# EAGLE schematic PIC32 (EAGLE 8.1.0)
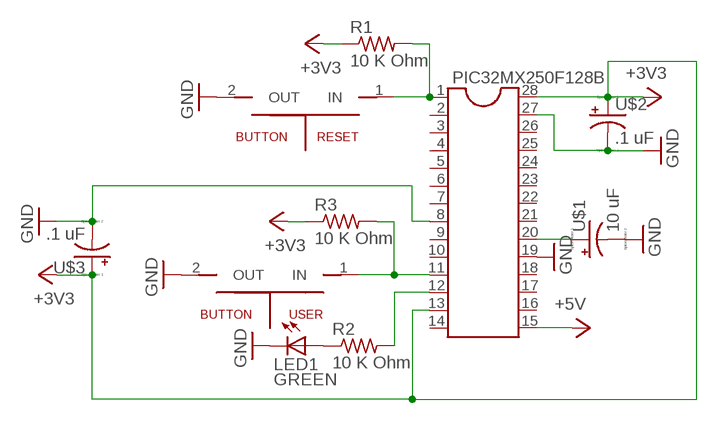
[diagram p0: schematic, sheet 1]

## Parts
LED1  GREEN  LED  [SMARTLED-TTW]
PIC32MX250F128B  DIL28-3  [DIL28-3]
R1  10 K Ohm  R-US_0207/10  [0207/10]
R2  10 K Ohm  R-US_0207/10  [0207/10]
R3  10 K Ohm  R-US_0207/10  [0207/10]
RESET  BUTTON  [BUTTON]
U$1  10 uF  CAP-5  [E2,5-5]
U$2  .1 uF  CAP-4  [E1,8-4]
U$3  .1 uF  CAP-4  [E1,8-4]
USER  BUTTON  [BUTTON]

## Nets
+3V3: PIC32MX250F128B.13 PIC32MX250F128B.28 R1.1 R3.1 U$2.+ U$3.+
+5V: PIC32MX250F128B.15
GND: LED1.C@1(C) PIC32MX250F128B.8 PIC32MX250F128B.19 PIC32MX250F128B.27 RESET.2(OUT) U$1.- U$2.- U$3.- USER.2(OUT)
N$1: PIC32MX250F128B.20 U$1.+
N$2: PIC32MX250F128B.1 R1.2 RESET.1(IN)
N$3: LED1.A@1(A) R2.1
N$4: PIC32MX250F128B.12 R2.2
N$5: PIC32MX250F128B.11 R3.2 USER.1(IN)
Unconnected: PIC32MX250F128B.2 PIC32MX250F128B.3 PIC32MX250F128B.4 PIC32MX250F128B.5 PIC32MX250F128B.6 PIC32MX250F128B.7 PIC32MX250F128B.9 PIC32MX250F128B.10 PIC32MX250F128B.14 PIC32MX250F128B.16 PIC32MX250F128B.17 PIC32MX250F128B.18 PIC32MX250F128B.21 PIC32MX250F128B.22 PIC32MX250F128B.23 PIC32MX250F128B.24 PIC32MX250F128B.25 PIC32MX250F128B.26

## Library data of the parts
LED1 = ME433:LED: LED OSRAM: - CHIPLED LG R971, LG N971, LY N971, LG Q971, LY Q971, LO R971, LY R971 LH N974, LH R974 LS Q976, LO Q976, LY Q976 LO Q996 - Hyper CHIPLED LW Q18S LB Q993, LB Q99A, LB R99A - SideLED LS A670, LO A670, LY A670, LG A670, LP A670 LB A673, LV A673, LT A673, LW A673 LH A674 LY A675 LS A676, LA A676, LO A676, LY A676, LW A676 LS A679, LY A679, LG A679 - Hyper Micro SIDELED® LS Y876, LA Y876, LO Y876, LY Y876 LT Y87S - SmartLED LW L88C, LW L88S LB L89C, LB L89S, LG L890 LS L89K, LO L89K, LY L89K LS L896, LA L896, LO L896, LY L896 - TOPLED LS T670, LO T670, LY T670, LG T670, LP T670 LSG T670, LSP T670, LSY T670, LOP T670, LYG T670 LG T671, LOG T671, LSG T671 LB T673, LV T673, LT T673, LW T673 LH T674 LS T676, LA T676, LO T676, LY T676, LB T676, LH T676, LSB T676, LW T676 LB T67C, LV T67C, LT T67C, LS T67K, LO T67K, LY T67K, LW E67C LS E67B, LA E67B, LO E67B, LY E67B, LB E67C, LV E67C, LT E67C LW T67C LS T679, LY T679, LG T679 LS T770, LO T770, LY T770, LG T770, LP T770 LB T773, LV T773, LT T773, LW T773 LH T774 LS E675, LA E675, LY E675, LS T675 LS T776, LA T776, LO T776, LY T776, LB T776 LHGB T686 LT T68C, LB T68C - Hyper Mini TOPLED® LB M676 - Mini TOPLED Santana® LG M470 LS M47K, LO M47K, LY M47K Source: http://www.osram.convergy.de LUXEON: - LUMILED® LXK2-PW12-R00, LXK2-PW12-S00, LXK2-PW14-U00, LXK2-PW14-V00 LXK2-PM12-R00, LXK2-PM12-S00, LXK2-PM14-U00 LXK2-PE12-Q00, LXK2-PE12-R00, LXK2-PE12-S00, LXK2-PE14-T00, LXK2-PE14-U00 LXK2-PB12-K00, LXK2-PB12-L00, LXK2-PB12-M00, LXK2-PB14-N00, LXK2-PB14-P00, LXK2-PB14-Q00 LXK2-PR12-L00, LXK2-PR12-M00, LXK2-PR14-Q00, LXK2-PR14-R00 LXK2-PD12-Q00, LXK2-PD12-R00, LXK2-PD12-S00 LXK2-PH12-R00, LXK2-PH12-S00 LXK2-PL12-P00, LXK2-PL12-Q00, LXK2-PL12-R00 Source: www.luxeon.com KINGBRIGHT: KA-3528ASYC Source: www.kingbright.com
PIC32MX250F128B = ME433:DIL28: Dual In Line
R1-R3 = ME433:R-US_: RESISTOR, American symbol
RESET USER = ME433:BUTTON
U$1 = ME433:CAP-5
U$2 U$3 = ME433:CAP-4